# EAGLE schematic miavita (EAGLE 5.11)
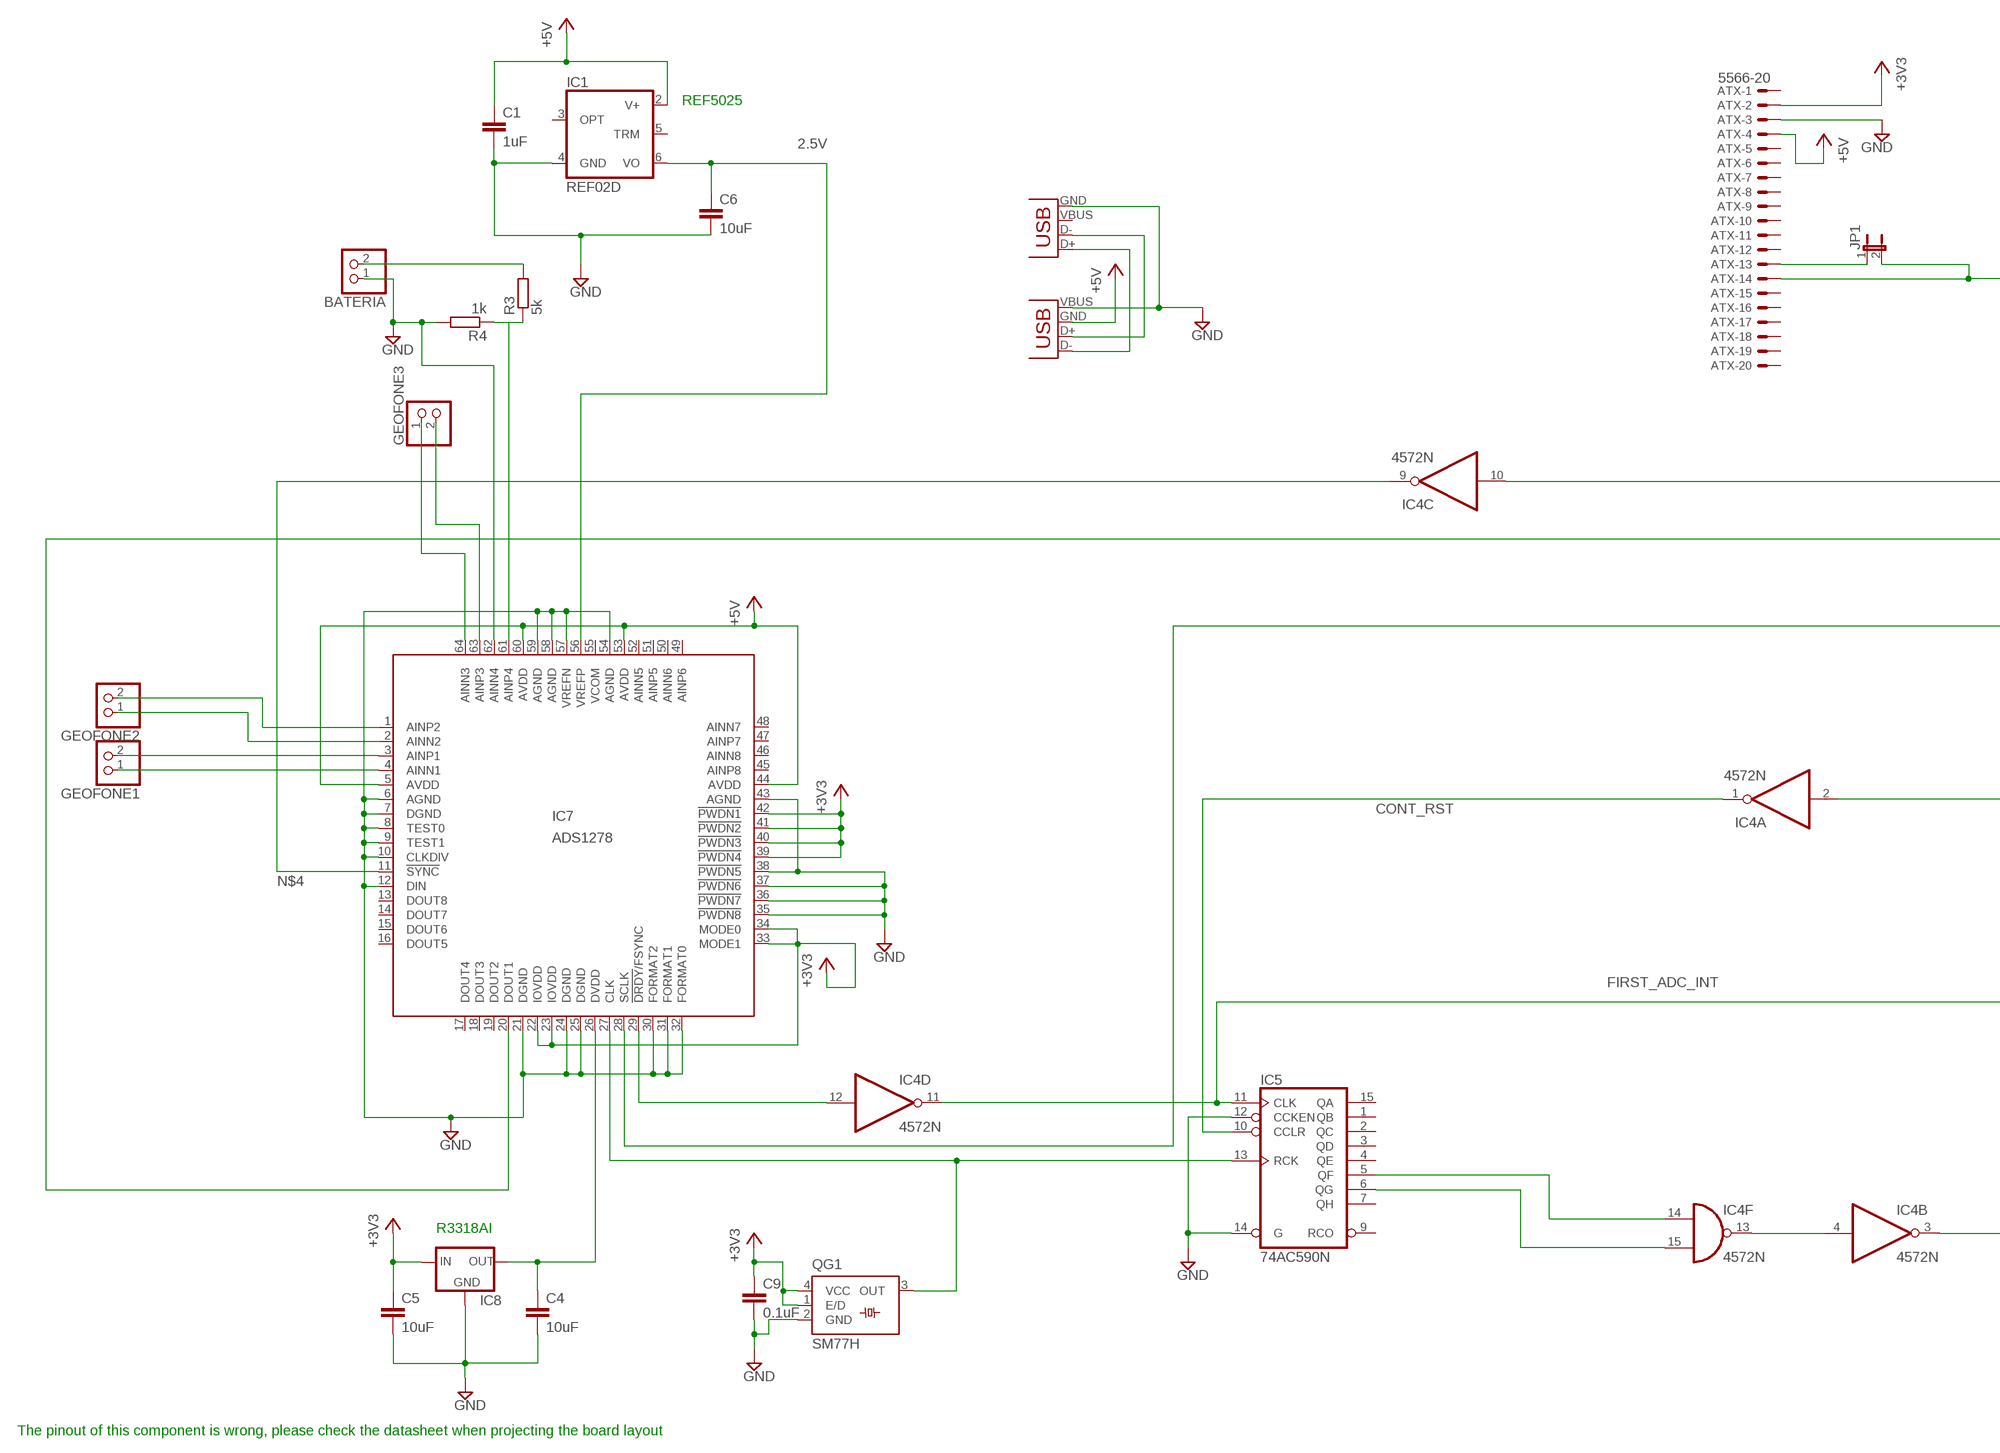
[diagram p0: schematic, sheet 1, part 1 of 2]
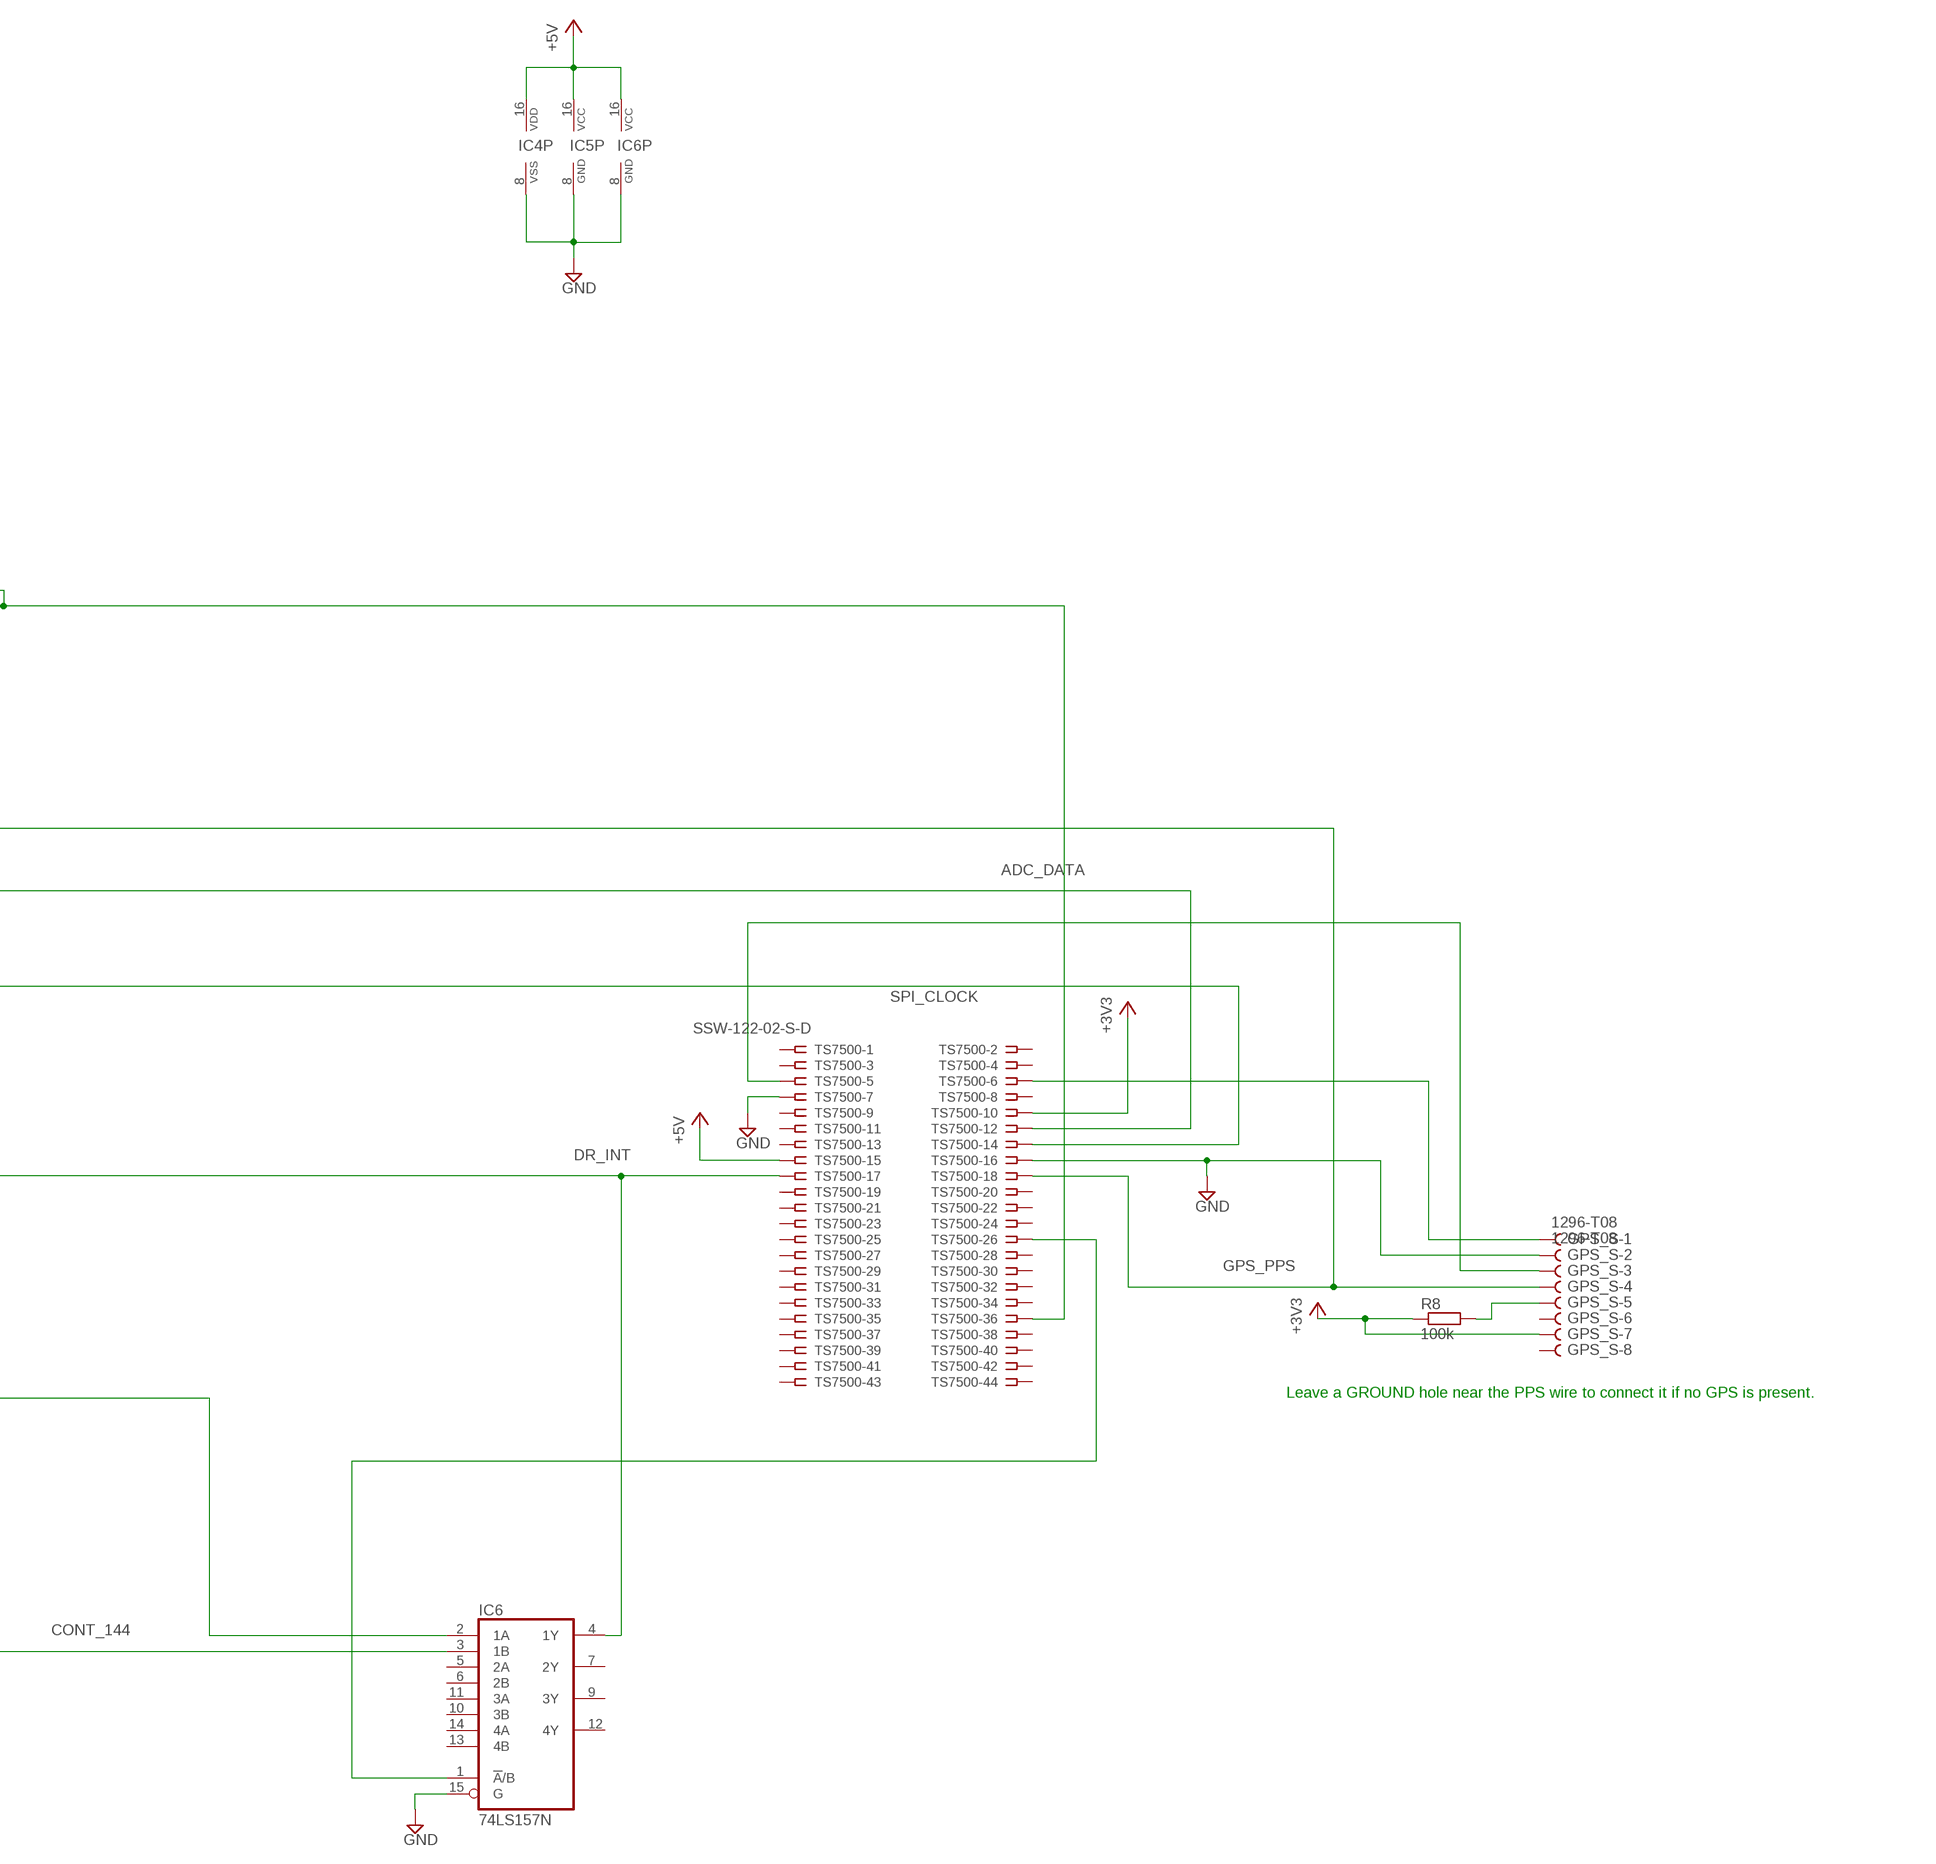
[diagram p1: schematic, sheet 1, part 2 of 2]

## Parts
ATX  5566-20  [5566-20]
BATERIA  PINHD-1X2  [1X02]
C1  1uF  C5/2.5  [C5B2.5]
C4  10uF  C5/2.5  [C5B2.5]
C5  10uF  C5/2.5  [C5B2.5]
C6  10uF  C5/2.5  [C5B2.5]
C9  0.1uF  C5/2.5  [C5B2.5]
GEOFONE1  PINHD-1X2  [1X02]
GEOFONE2  PINHD-1X2  [1X02]
GEOFONE3  PINHD-1X2  [1X02]
GPS_S  1296-T08  [1296-08]
IC1  REF02D  [SO08]
IC4  4572N  [DIL16]
IC5  74AC590N  [DIL16]
IC6  74LS157N  [DIL16]
IC7  ADS1278  [HTQFP-64-PAP]
IC8  XC63FPM  [SOT23]
JP1  JP1E  [JP1]
QG1  SM77H  [SM77H]
R3  5k  R-EU_0204/5  [0204/5]
R4  1k  R-EU_0204/5  [0204/5]
R8  100k  R-EU_0204/5  [0204/5]
TS7500  SSW-122-02-S-D  [SSW-122-02-S-D]
USBA  USB-A-H  [USB-A-H]
USBB  USBPTH  [USB-B-PTH]

## Nets
2.5V: C6.1 IC1.6(VO) IC7.56(VREFP)
+1V8: C4.1 IC7.26(DVDD) IC8.2(OUT)
+3V3: ATX.2 C5.1 C9.1 GPS_S.7 IC7.22(IOVDD) IC7.23(IOVDD) IC7.33(MODE1) IC7.34(MODE0) IC7.39(!PWDN4) IC7.40(!PWDN3) IC7.41(!PWDN2) IC7.42(!PWDN1) IC8.3(IN) QG1.1(E/D) QG1.4(VCC) R8.1 TS7500.10
+5V: ATX.4 C1.1 IC1.2(V+) IC4.16(P:VDD) IC5.16(VCC) IC6.16(VCC) IC7.5(AVDD) IC7.44(AVDD) IC7.53(AVDD) IC7.60(AVDD) TS7500.15 USBA.GND(VBUS)
ADC_DATA: IC7.20(DOUT1) TS7500.12
CONT_144: IC4.3(B:O) IC6.3(1B)
CONT_RST: IC4.1(A:O) IC5.10(CCLR)
DR_INT: IC4.2(A:I) IC6.4(1Y) TS7500.17
FIRST_ADC_INT: IC4.11(D:O) IC5.11(CLK) IC6.2(1A)
GND: ATX.3 BATERIA.1 C1.2 C4.2 C5.2 C6.2 C9.2 GPS_S.2 IC1.4(GND) IC4.8(P:VSS) IC5.8(GND) IC5.12(CCKEN) IC5.14(G) IC6.8(GND) IC6.15(G) IC7.6(AGND) IC7.7(DGND) IC7.8(TEST0) IC7.9(TEST1) IC7.10(CLKDIV) IC7.12(DIN) IC7.21(DGND) IC7.24(DGND) IC7.25(DGND) IC7.30(FORMAT2) IC7.31(FORMAT1) IC7.32(FORMAT0) IC7.35(!PWDN8) IC7.36(!PWDN7) IC7.37(!PWDN6) IC7.38(!PWDN5) IC7.43(AGND) IC7.54(AGND) IC7.57(VREFN) IC7.58(AGND) IC7.59(AGND) IC7.62(AINN4) IC8.1(GND) QG1.2(GND) R4.2 TS7500.7 TS7500.16 USBA.VBUS(GND) USBB.GND
GPS_PPS: GPS_S.4 IC4.10(C:I) TS7500.18
N$1: IC6.1(!A!/B) TS7500.26
N$2: IC4.15(F:I1) IC5.6(QG)
N$3: IC4.14(F:I0) IC5.5(QF)
N$4: IC4.9(C:O) IC7.11(!SYNC)
N$5: IC4.4(B:I) IC4.13(F:O)
N$6: ATX.14 JP1.2 TS7500.36
N$7: IC4.12(D:I) IC7.29(!DRDY!/FSYNC)
N$8: GEOFONE1.2 IC7.3(AINP1)
N$9: ATX.13 JP1.1
N$10: GEOFONE1.1 IC7.4(AINN1)
N$11: GEOFONE2.2 IC7.1(AINP2)
N$12: IC7.61(AINP4) R3.1 R4.1
N$13: USBA.D+(D-) USBB.D-
N$14: GEOFONE3.2 IC7.63(AINP3)
N$15: GEOFONE3.1 IC7.64(AINN3)
N$17: IC5.13(RCK) IC7.27(CLK) QG1.3(OUT)
N$18: USBA.D-(D+) USBB.D+
N$19: BATERIA.2 R3.2
N$42: GPS_S.1 TS7500.6
N$43: GPS_S.3 TS7500.5
N$44: GPS_S.5 R8.2
N$46: GEOFONE2.1 IC7.2(AINN2)
SPI_CLOCK: IC7.28(SCLK) TS7500.14
Unconnected: ATX.1 ATX.5 ATX.6 ATX.7 ATX.8 ATX.9 ATX.10 ATX.11 ATX.12 ATX.15 ATX.16 ATX.17 ATX.18 ATX.19 ATX.20 GPS_S.6 GPS_S.8 IC1.3(OPT) IC1.5(TRM) IC4.5(E:O) IC4.6(E:I0) IC4.7(E:I1) IC5.1(QB) IC5.2(QC) IC5.3(QD) IC5.4(QE) IC5.7(QH) IC5.9(RCO) IC5.15(QA) IC6.5(2A) IC6.6(2B) IC6.7(2Y) IC6.9(3Y) IC6.10(3B) IC6.11(3A) IC6.12(4Y) IC6.13(4B) IC6.14(4A) IC7.13(DOUT8) IC7.14(DOUT7) IC7.15(DOUT6) IC7.16(DOUT5) IC7.17(DOUT4) IC7.18(DOUT3) IC7.19(DOUT2) IC7.45(AINP8) IC7.46(AINN8) IC7.47(AINP7) IC7.48(AINN7) IC7.49(AINP6) IC7.50(AINN6) IC7.51(AINP5) IC7.52(AINN5) IC7.55(VCOM) IC7.EXP1(EXP) IC7.EXP2(EXP) IC7.EXP3(EXP) IC7.EXP4(EXP) IC7.EXP5(EXP) IC7.EXP6(EXP) IC7.EXP7(EXP) IC7.EXP8(EXP) IC7.EXP9(EXP) IC7.EXP10(EXP) IC7.EXP11(EXP) IC7.EXP12(EXP) IC7.EXP13(EXP) IC7.EXP14(EXP) IC7.EXP15(EXP) IC7.EXP16(EXP) IC7.EXP17(EXP) IC7.EXP18(EXP) IC7.EXP19(EXP) IC7.EXP20(EXP) IC7.EXP21(EXP) IC7.EXP22(EXP) IC7.EXP23(EXP) IC7.EXP24(EXP) IC7.EXP25(EXP) TS7500.1 TS7500.2 TS7500.3 TS7500.4 TS7500.8 TS7500.9 TS7500.11 TS7500.13 TS7500.19 TS7500.20 TS7500.21 TS7500.22 TS7500.23 TS7500.24 TS7500.25 TS7500.27 TS7500.28 TS7500.29 TS7500.30 TS7500.31 TS7500.32 TS7500.33 TS7500.34 TS7500.35 TS7500.37 TS7500.38 TS7500.39 TS7500.40 TS7500.41 TS7500.42 TS7500.43 TS7500.44 USBB.VBUS

## Notes on the sheet
- REF5025
- Leave a GROUND hole near the PPS wire to connect it if no GPS is present.
- R3318AI
- The pinout of this component is wrong, please check the datasheet when projecting the board layout

## Library data of the parts
ATX = con-molex:5566-20: Mini FIT connector 20 pol ATX PC-Motherboard Power connector Source: http://www.molex.com; OC_FARNELL: unknown; OC_NEWARK: unknown
BATERIA GEOFONE1-GEOFONE3 = pinhead:PINHD-1X2: PIN HEADER
C1 C4-C6 C9 = capacitor-wima:C: CAPACITOR naming: grid - package width
GPS_S = con-leotronics:1296-T08: 1.27mm SINGLE ROW FEMALE SOCKET Source: http://www.leotronics.co.uk/Conexcon/Data%20Sheets/sec.%20A/1296ing.pdf; OC_FARNELL: unknown; OC_NEWARK: unknown
IC1 = linear:REF02: VOLTAGE REFERENCE
IC4 = 45xx:4572: INVERTER/OR/NOR (MC14572BCP)
IC5 = 74xx-eu:74*590: 8-bit binary COUNTER, output register
IC6 = 74xx-eu:74*157: Quadruple 2-line to 1-line data SELECTOR/MULTIPLEXER
IC7 = texas:ADS1278: Quad/Octal, Simultaneous Sampling, 24-Bit Analog-to-Digital Converters ADS1274 / ADS1278 Auto generated by make-symbol-device-package-bsdl.ulp Rev. 29 Source: http://focus.ti.com/lit/ds/symlink/ads1274.pdf; MPN: ADS1278IPAPT; OC_FARNELL: 1603419; OC_NEWARK: 50M8811
IC8 = v-reg:XC63FP: Positiv Voltage Regulators www.torex.co.jp/english/product/pro02/pdf/0201_xc62fp.pdf
JP1 = jumper:JP1E: JUMPER
QG1 = crystal:SM77H: 3.3V CMOS Clock Oscillator Source: www.pletronics.com .. sm77h%203.3v.pdf; OC_FARNELL: unknown; OC_NEWARK: unknown
R3 R4 = rcl:R-EU_: RESISTOR, European symbol
R8 = resistor:R-EU_: RESISTOR, European symbol
TS7500 = con-samtec:SSW-122-02-S-D: THROUGH-HOLE .025" SQ POST SOCKET Source: Samtec SSW.pdf; MPN: SSW-122-02-S-D; OC_FARNELL: unknown; OC_NEWARK: 11P9673
USBA USBB = SparkFun:USB: USB Connectors USB-B-PTH is fully proven SKU : PRT-00139 USB-miniB is fully proven SKU : PRT-00587 USB-A-PCB is untested. USB-A-H is throughly reviewed, but untested. Spark Fun Electronics SKU : PRT-00437 USB-B-SMT is throughly reviewed, but untested. Needs silkscreen touching up. USB-A-S has not been used/tested USB-MB-H has not been used/tested